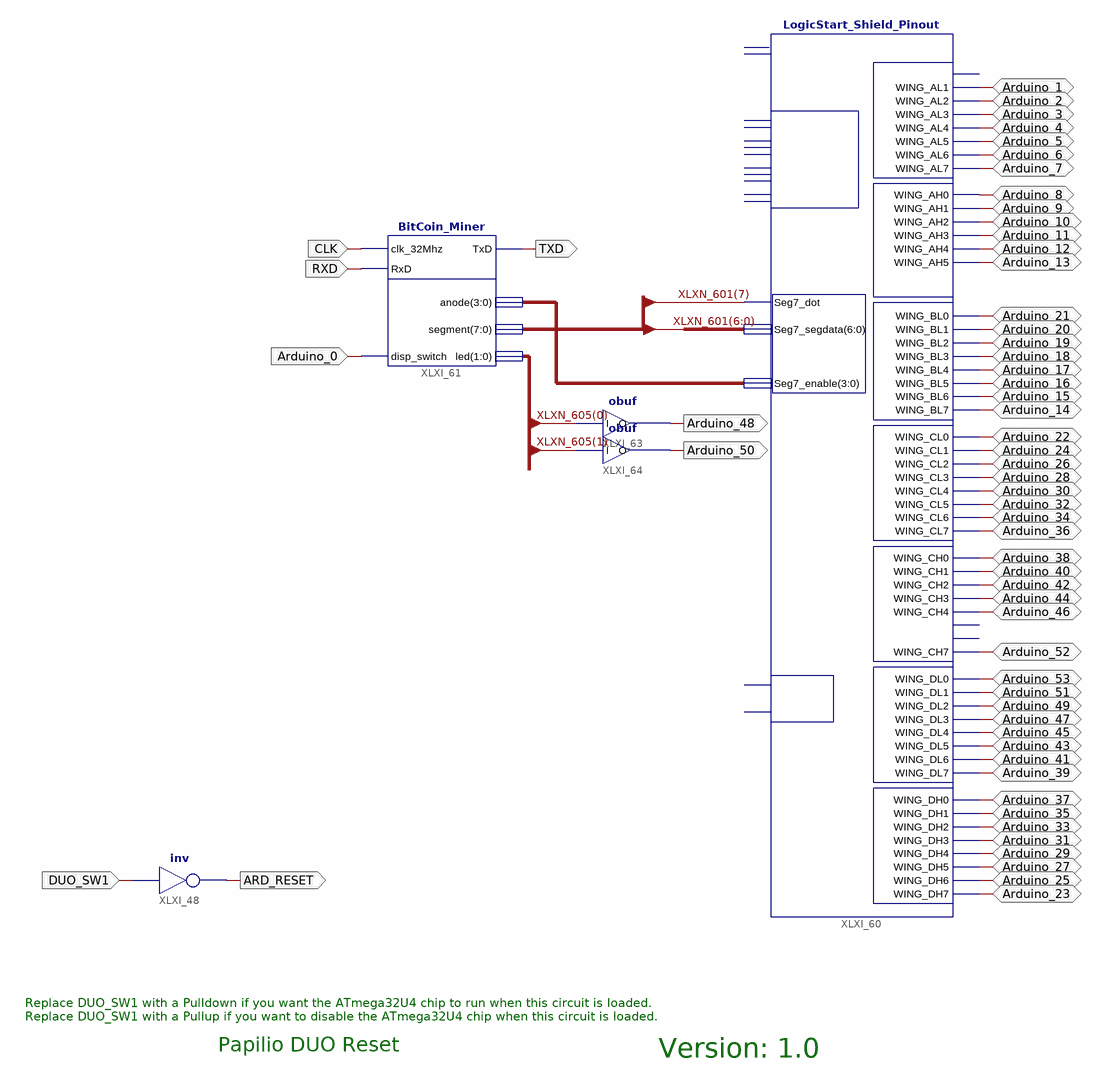
[diagram p0: schematic sheet 1]
// Xilinx ISE schematic Papilio_DUO_LX9.sch (spartan6) as structural Verilog: 5 symbols, 59 ports
module Papilio_DUO_LX9 (
  input  DUO_SW1,
  input  CLK,
  input  RXD,
  input  Arduino_0,
  inout  Arduino_1,
  inout  Arduino_2,
  inout  Arduino_3,
  inout  Arduino_4,
  inout  Arduino_5,
  inout  Arduino_6,
  inout  Arduino_7,
  inout  Arduino_8,
  inout  Arduino_9,
  inout  Arduino_10,
  inout  Arduino_11,
  inout  Arduino_12,
  inout  Arduino_13,
  inout  Arduino_21,
  inout  Arduino_20,
  inout  Arduino_19,
  inout  Arduino_18,
  inout  Arduino_17,
  inout  Arduino_16,
  inout  Arduino_15,
  inout  Arduino_14,
  inout  Arduino_22,
  inout  Arduino_24,
  inout  Arduino_26,
  inout  Arduino_28,
  inout  Arduino_30,
  inout  Arduino_32,
  inout  Arduino_34,
  inout  Arduino_36,
  inout  Arduino_38,
  inout  Arduino_40,
  inout  Arduino_42,
  inout  Arduino_44,
  inout  Arduino_46,
  inout  Arduino_52,
  inout  Arduino_53,
  inout  Arduino_51,
  inout  Arduino_49,
  inout  Arduino_47,
  inout  Arduino_45,
  inout  Arduino_43,
  inout  Arduino_41,
  inout  Arduino_39,
  inout  Arduino_37,
  inout  Arduino_35,
  inout  Arduino_33,
  inout  Arduino_31,
  inout  Arduino_29,
  inout  Arduino_27,
  inout  Arduino_25,
  inout  Arduino_23,
  output ARD_RESET,
  output TXD,
  output Arduino_48,
  output Arduino_50
);

  wire [1:0] XLXN_605;
  wire [3:0] XLXN_600;
  wire [7:0] XLXN_601;

  not XLXI_48 (ARD_RESET, DUO_SW1);
  LogicStart_Shield_Pinout XLXI_60 (
    .WING_AL1(Arduino_1), .WING_AL2(Arduino_2), .WING_AL3(Arduino_3), .WING_AL4(Arduino_4),
    .WING_AL5(Arduino_5), .WING_AL6(Arduino_6), .WING_AL7(Arduino_7), .WING_AH0(Arduino_8),
    .WING_AH1(Arduino_9), .WING_AH2(Arduino_10), .WING_AH3(Arduino_11), .WING_AH4(Arduino_12),
    .WING_AH5(Arduino_13), .WING_BL0(Arduino_21), .WING_BL1(Arduino_20), .WING_BL2(Arduino_19),
    .WING_BL3(Arduino_18), .WING_BL4(Arduino_17), .WING_BL5(Arduino_16), .WING_BL6(Arduino_15),
    .WING_BL7(Arduino_14), .Seg7_dot(XLXN_601[7]), .Seg7_enable(XLXN_600), .Seg7_segdata(XLXN_601[6:0]),
    .WING_CL0(Arduino_22), .WING_CL1(Arduino_24), .WING_CL2(Arduino_26), .WING_CL3(Arduino_28),
    .WING_CL4(Arduino_30), .WING_CL5(Arduino_32), .WING_CL6(Arduino_34), .WING_CL7(Arduino_36),
    .WING_CH0(Arduino_38), .WING_CH1(Arduino_40), .WING_CH2(Arduino_42), .WING_CH3(Arduino_44),
    .WING_CH4(Arduino_46), .WING_CH7(Arduino_52), .WING_DL0(Arduino_53), .WING_DL1(Arduino_51),
    .WING_DL2(Arduino_49), .WING_DL3(Arduino_47), .WING_DL4(Arduino_45), .WING_DL5(Arduino_43),
    .WING_DL6(Arduino_41), .WING_DL7(Arduino_39), .WING_DH0(Arduino_37), .WING_DH1(Arduino_35),
    .WING_DH2(Arduino_33), .WING_DH3(Arduino_31), .WING_DH4(Arduino_29), .WING_DH5(Arduino_27),
    .WING_DH6(Arduino_25), .WING_DH7(Arduino_23));  // open: gpio_bus_out, gpio_bus_in, WING_AL0, VGA_Red2, VGA_Red1, VGA_Red0, VGA_Green2, VGA_Green1, VGA_Green0, VGA_Blue1, VGA_Blue0, VGA_Hsync, VGA_Vsync, Audio_Left, WING_CH5, WING_CH6, Audio_Right
  BitCoin_Miner XLXI_61 (
    .clk_32Mhz(CLK), .TxD(TXD), .RxD(RXD), .disp_switch(Arduino_0), .anode(XLXN_600), .segment(XLXN_601),
    .led(XLXN_605));
  obuf XLXI_63 (.I(XLXN_605[0]), .O(Arduino_48));
  obuf XLXI_64 (.I(XLXN_605[1]), .O(Arduino_50));

  // Notes on the sheet:
  //   Replace DUO_SW1 with a Pulldown if you want the ATmega32U4 chip to run when this circuit is loaded.
  //   Replace DUO_SW1 with a Pullup if you want to disable the ATmega32U4 chip when this circuit is loaded.
  //   Papilio DUO Reset
  //   Version: 1.0
endmodule
